# EAGLE design main (EAGLE 9.5.2)
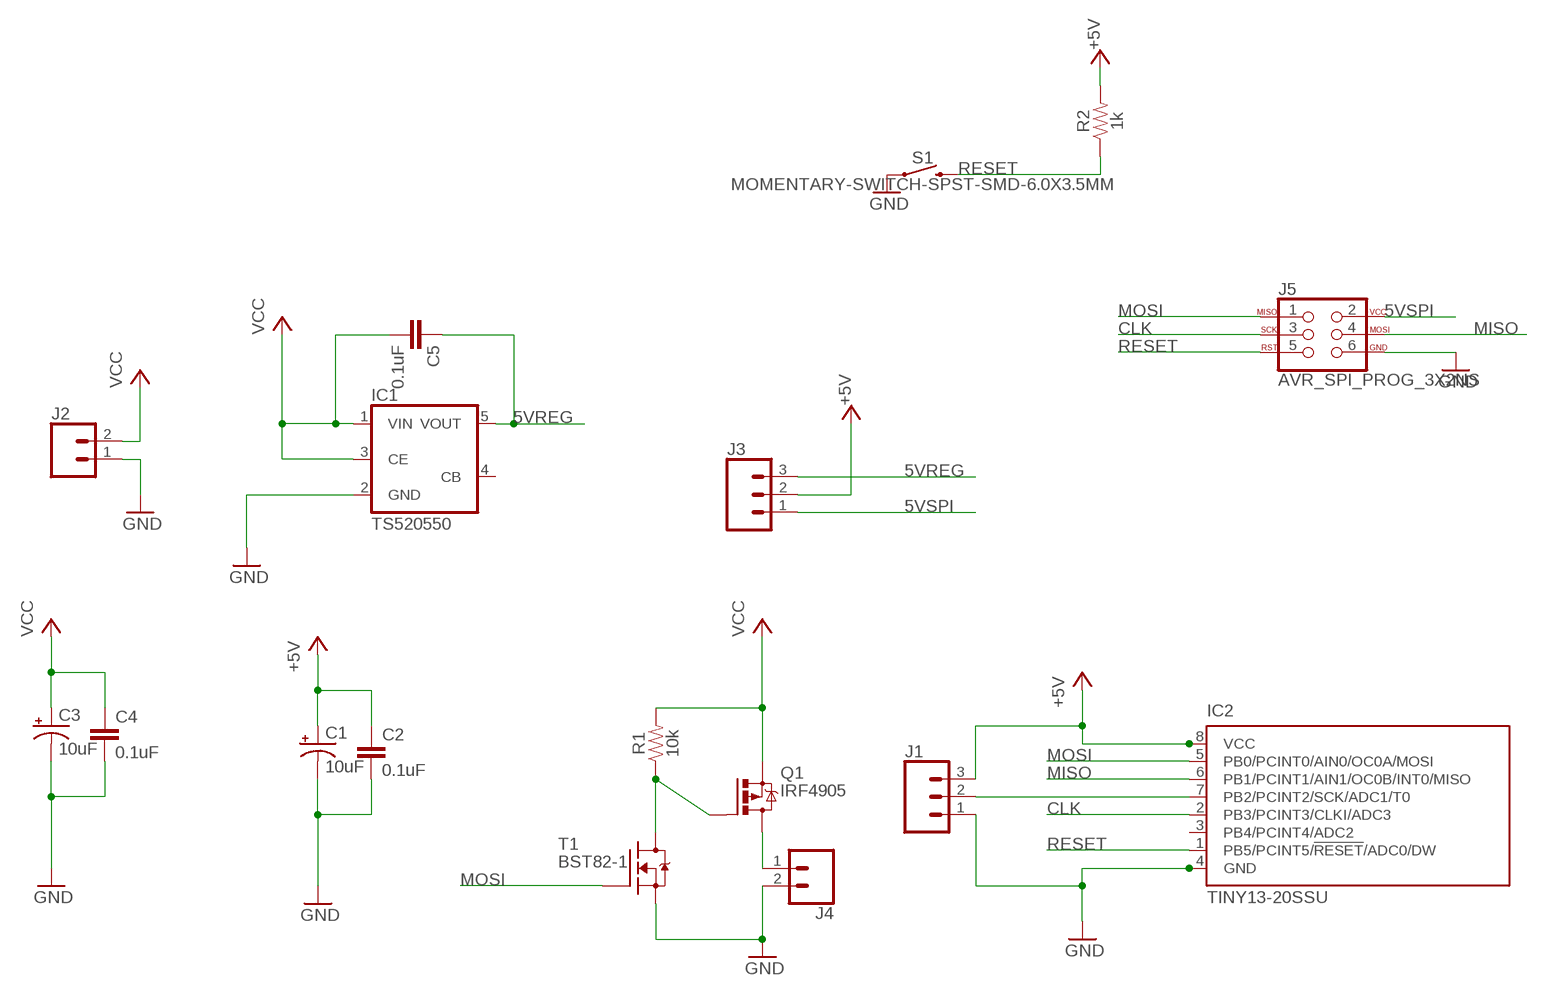
[diagram p0: schematic, sheet 1]

## Parts
C1  10uF  10UF-POLAR-RADIAL-2.5MM-25V-20%  [CPOL-RADIAL-2.5MM-5MM]
C2  0.1uF  0.1UF-0603-25V-5%  [0603]
C3  10uF  10UF-POLAR-RADIAL-2.5MM-25V-20%  [CPOL-RADIAL-2.5MM-5MM]
C4  0.1uF  0.1UF-0603-25V-5%  [0603]
C5  0.1uF  0.1UF-0603-25V-5%  [0603]
IC1  TS520550  [SOT25]
IC2  TINY13-20SSU  [8S1]
J1  CONN_03  [1X03]
J2  CONN_023.5MM_LOCK  [SCREWTERMINAL-3.5MM-2_LOCK]
J3  CONN_03  [1X03]
J4  CONN_023.5MM  [SCREWTERMINAL-3.5MM-2]
J5  AVR_SPI_PROG_3X2NS  [2X3-NS]
Q1  IRF4905  [TO220BH]
R1  10k  10KOHM-0603-1/10W-1%  [0603]
R2  1k  1KOHM-0603-1/10W-1%  [0603]
S1  MOMENTARY-SWITCH-SPST-SMD-6.0X3.5MM  [TACTILE_SWITCH_SMD_6.0X3.5MM]
T1  BST82-1  [SOT23]

## Nets
5VREG: C5.1 IC1.5(VOUT) J3.3
5VSPI: J3.1 J5.2
+5V: C1.1(+) C2.1 IC2.8(VCC) J1.3 J3.2 R2.2
CLK: IC2.2(PB3/PCINT3/CLKI/ADC3) J5.3
GND: C1.2(-) C2.2 C3.2(-) C4.2 IC1.2(GND) IC2.4(GND) J1.1 J2.1 J4.2 J5.6 S1.1 T1.2(S)
MISO: IC2.6(PB1/PCINT1/AIN1/OC0B/INT0/MISO) J5.4
MOSI: IC2.5(PB0/PCINT0/AIN0/OC0A/MOSI) J5.1 T1.1(G)
N$1: J4.1 Q1.D
N$2: IC2.7(PB2/PCINT2/SCK/ADC1/T0) J1.2
N$3: Q1.G R1.1 T1.3(D)
RESET: IC2.1(PB5/PCINT5/!RESET!/ADC0/DW) J5.5 R2.1 S1.2
VCC: C3.1(+) C4.1 C5.2 IC1.1(VIN) IC1.3(CE) J2.2 Q1.S R1.2
Unconnected: IC1.4(CB) IC2.3(PB4/PCINT4/ADC2)

## Library data of the parts
C1 C3 = SparkFun-Capacitors:10UF-POLAR: 10.0µF polarized capacitors A capacitor is a passive two-terminal electrical component used to store electrical energy temporarily in an electric field.; PROD_ID: CAP-08440
C2 C4 C5 = SparkFun-Capacitors:0.1UF: 0.1µF ceramic capacitors A capacitor is a passive two-terminal electrical component used to store electrical energy temporarily in an electric field.; PROD_ID: CAP-08604
IC1 = v-reg:TS5205: 150mA Low Noise LDO Voltage Regulator with Enable TSC [Taiwan Semiconductor Company, Ltd] Source: http://www.taiwansemi.com .. 5205_0409c.pdf
IC2 = atmel:TINY13: 8-bit AVR Microcontroller with 1K Bytes In-System Programmable Flash Source: http://www.atmel.com/dyn/resources/prod_documents/2535S.pdf; MPN: ATTINY13-20SSU; OC_FARNELL: 1455133; OC_NEWARK: 58M3771
J1 J3 = SparkFun-Connectors:CONN_03: Multi connection point. Often used as Generic Header-pin footprint for 0.1 inch spaced/style header connections On any of the 0.1 inch spaced packages, you can populate with these: Break Away Headers - Straight <https://www.sparkfun.com/products/116> (PRT-00116) Break Away Male Headers - Right Angle <https://www.sparkfun.com/products/553> (PRT-00553) Female Headers <https://www.sparkfun.com/products/115> (PRT-00115) Break Away Headers - Machine Pin <https://www.sparkfun.com/products/117> (PRT-00117) Break Away Female Headers - Swiss Machine Pin <https://www.sparkfun.com/products/743> (PRT-00743) Stackable Header - 3 Pin (Female, 0.1") <https://www.sparkfun.com/products/13875> (PRT-13875) For SCREWTERMINALS and SPRING TERMINALS visit here: Screw Terimnals on SparkFun.com <https://www.sparkfun.com/search/results?term=Screw+Terminals> (5mm/3.5mm/2.54mm spacing) This device is also useful as a general connection point to wire up your design to another part of your project. Our various solder wires solder well into these plated through hole pads. Hook-Up Wire - Assortment (Stranded, 22 AWG) <https://www.sparkfun.com/products/11375> (PRT-11375) Hook-Up Wire - Assortment (Solid Core, 22 AWG) <https://www.sparkfun.com/products/11367> (PRT-11367) View the entire wire category on our website here <https://www.sparkfun.com/categories/141> Special notes: Molex polarized connector foot print use with SKU : PRT-08232 with associated crimp pins and housings.
J2 J4 = SparkFun-Connectors:CONN_02: Multi connection point. Often used as Generic Header-pin footprint for 0.1 inch spaced/style header connections On any of the 0.1 inch spaced packages, you can populate with these: Break Away Headers - Straight <https://www.sparkfun.com/products/116> (PRT-00116) Break Away Male Headers - Right Angle <https://www.sparkfun.com/products/553> (PRT-00553) Female Headers <https://www.sparkfun.com/products/115> (PRT-00115) Break Away Headers - Machine Pin <https://www.sparkfun.com/products/117> (PRT-00117) Break Away Female Headers - Swiss Machine Pin <https://www.sparkfun.com/products/743> (PRT-00743) For SCREWTERMINALS and SPRING TERMINALS visit here: Screw Terimnals on SparkFun.com <https://www.sparkfun.com/search/results?term=Screw+Terminals> (5mm/3.5mm/2.54mm spacing) This device is also useful as a general connection point to wire up your design to another part of your project. Our various solder wires solder well into these plated through hole pads. Hook-Up Wire - Assortment (Stranded, 22 AWG) <https://www.sparkfun.com/products/11375> (PRT-11375) Hook-Up Wire - Assortment (Solid Core, 22 AWG) <https://www.sparkfun.com/products/11367> (PRT-11367) View the entire wire category on our website here <https://www.sparkfun.com/categories/141> Special notes: Molex polarized connector foot print use with: PRT-08233 with associated crimp pins and housings. 2.54_SCREWTERM for use with PRT-10571. 3.5mm Screw Terminal footprints for PRT-08084 5mm Screw Terminal footprints for use with PRT-08432; PROD_ID: CONN-08399
J5 = SparkFun-Connectors:AVR_SPI_PROG_3X2: AVR ISP 6 Pin This is the reduced ISP connector for AVR programming. Common on Arduino. This footprint will take up less PCB space and can be used with a 10-pin to 6-pin adapter such as SKU: BOB-08508 **Special note about "TEST_POINT" package. The stop mask is on the top side, so if you want your programming test points to be on the bottom of your board, make sure to place this package on the bottom side of the board. This also ensure that the orientation to program from the bottom side will be correct. SparkFun Products: SparkFun ISP Pogo Adapter <https://www.sparkfun.com/products/11591> - NS Tiny AVR Programmer <https://www.sparkfun.com/products/11801> -PTH
Q1 = transistor-power:IRF4905: P-Channel HEXFET® Power MOSFET RDS(on)= 0.02 Ohm, ID = -74A Source: http://www.irf.com/product-info/datasheets/data/irf4905pbf.pdf
R1 = SparkFun-Resistors:10KOHM: 10kΩ resistor A resistor is a passive two-terminal electrical component that implements electrical resistance as a circuit element. Resistors act to reduce current flow, and, at the same time, act to lower voltage levels within circuits. - Wikipedia; PROD_ID: RES-00824
R2 = SparkFun-Resistors:1KOHM: 1kΩ resistor A resistor is a passive two-terminal electrical component that implements electrical resistance as a circuit element. Resistors act to reduce current flow, and, at the same time, act to lower voltage levels within circuits. - Wikipedia; PROD_ID: RES-07856
S1 = SparkFun-Switches:MOMENTARY-SWITCH-SPST: Momentary Switch (Pushbutton) - SPST Normally-open (NO) SPST momentary switches (buttons, pushbuttons). Variants PTH-12MM - 12mm square, through-hole Momentary Pushbutton Switch - 12mm Square <https://www.sparkfun.com/products/9190> (COM-09190) PTH-6.0MM, PTH-6.0MM-KIT - 6.0mm square, through-hole Mini Pushbutton Switch <https://www.sparkfun.com/products/97> (COM-00097) KIT package intended for soldering kit's - only one side of pads' copper is exposed. PTH-RIGHT-ANGLE-KIT - Right-angle, through-hole Right Angle Tactile Button <https://www.sparkfun.com/products/10791> - Used on SparkFun BigTime Watch Kit <https://www.sparkfun.com/products/11734> SMD-12MM - 12mm square, surface-mount Tactile Button - SMD (12mm) <https://www.sparkfun.com/products/12993> (COM-12993) Used on SparkFun PicoBoard <https://www.sparkfun.com/products/11888> SMD-4.5MM - 4.5mm Square Trackball Switch Used on SparkFun Blackberry Trackballer Breakout <https://www.sparkfun.com/products/13169> SMD-4.6MMX2.8MM - 4.60mm x 2.80mm, surface mount Used on SparkFun SAMD21 Mini Breakout <https://www.sparkfun.com/products/13664> SMD-5.2MM, SMD-5.2-REDUNDANT - 5.2mm square, surface-mount Mini Pushbutton Switch - SMD <https://www.sparkfun.com/products/8720> (COM-08720) Used on Arduino Pro Mini <https://www.sparkfun.com/products/11114> REDUNDANT package connects both switch circuits together SMD-6.0X3.5MM - 6.0 x 3.5mm, surface mount Momentary Reset Switch SMD <https://www.sparkfun.com/products/8229> (COM-08229) SMD-6.2MM-TALL - 6.2mm square, surface mount Tactile Button - SMD (6mm) <https://www.sparkfun.com/products/12992> Used on SparkFun Digital Sandbox <https://www.sparkfun.com/products/12651> SMD-RIGHT-ANGLE - Right-angle, surface mount Used on SparkFun Block for Intel® Edison - Arduino <https://www.sparkfun.com/products/13036>; PROD_ID: SWCH-00815; SF_SKU: COM-08229
T1 = Test:BST82-1

## Board
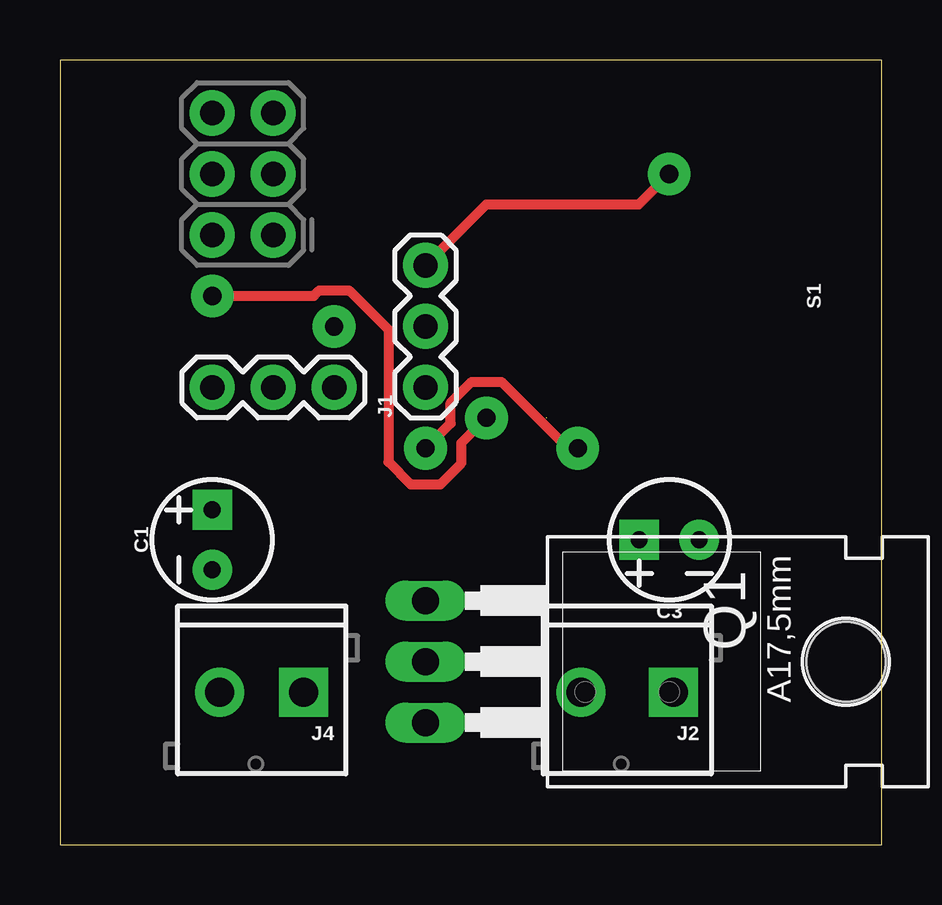
[diagram p1: board, top side]
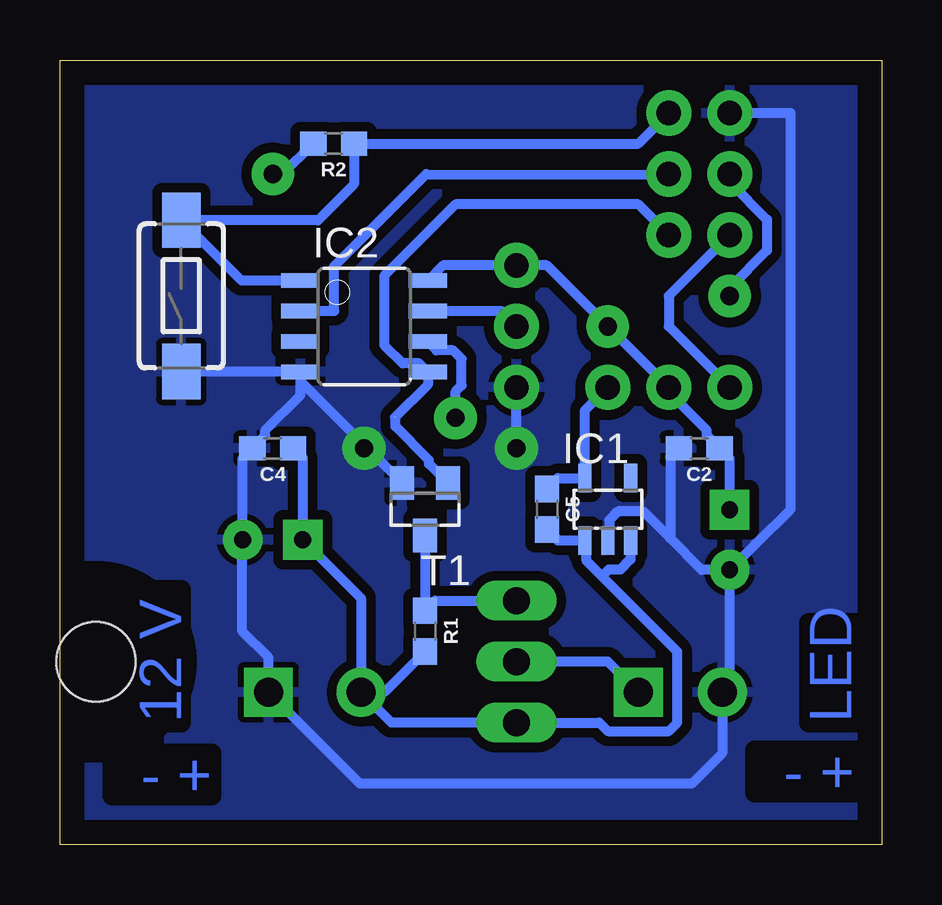
[diagram p2: board, bottom side, seen from below]

Size 34.27 x 32.69 mm. Coordinates in mm from the lower left corner, seen from the top.
Outline: 0,0 34.27,0 34.27,32.69 0,32.69 0,0
Copper layers (1*16): Top 0.035mm / dielectric 1.5mm / Bottom 0.035mm
Design rules "default *": minimum track width 16mil, minimum drill 0.35mm, track to track 16mil, track to pad 16mil, pad to pad 16mil, via to via 16mil, smd to smd 16mil, copper to edge 40mil, drill to drill 6mil, minimum pad ring 10mil, minimum via ring 8mil, stop-mask expansion 4mil, vias tented up to drill 0mil, thermal gap 10mil

### Footprints (pad centres in the part's own frame; a part is rotated, then mirrored left to right if it is on the bottom)
CPOL-RADIAL-2.5MM-5MM = drill 0.7 pad 1.651 square: 1 1.25,0 | drill 0.7 pad 1.651: 2 -1.25,0
0603 = smd 1.1 x 1: 1 -0.85,0; 2 0.85,0
SOT25 = smd 0.55 x 1.2: 1 -0.95,-1.3; 2 0,-1.3; 3 0.95,-1.3; 4 0.95,1.3; 5 -0.95,1.3
8S1 = smd 0.6 x 1.6: 1 -1.905,-2.654; 2 -0.645,-2.654; 3 0.625,-2.654; 4 1.895,-2.654; 5 1.905,2.654; 6 0.635,2.654; 7 -0.635,2.654; 8 -1.905,2.654
1X03 = drill 1.016 pad 1.88: 1 0,0; 2 2.54,0; 3 5.08,0
SCREWTERMINAL-3.5MM-2_LOCK = drill 1.2 pad 2.032 square: 1 -0.178,0 | drill 1.2 pad 2.032: 2 3.678,0
SCREWTERMINAL-3.5MM-2 = drill 1.2 pad 2.032 square: 1 0,0 | drill 1.2 pad 2.032: 2 3.5,0
2X3-NS = drill 1.016 pad 1.88: 1 -2.54,-1.27; 2 -2.54,1.27; 3 0,-1.27; 4 0,1.27; 5 2.54,-1.27; 6 2.54,1.27
TO220BH = drill 1.118 long: D 0,-6.35; G -2.54,-6.35; S 2.54,-6.35 | hole 3.302: 0,11.176
TACTILE_SWITCH_SMD_6.0X3.5MM = smd 2.3 x 1.6: 1 -3.15,0; 2 3.15,0
SOT23 = smd 1 x 1.4: 1 -0.95,-1.1; 2 0.95,-1.1; 3 0,1.1

### Placement (x,y rotation side)
C1  6.35,12.7 90 top
C2  7.62,16.51 180 bottom
C3  25.4,12.7 180 top
C4  25.4,16.51 180 bottom
C5  13.97,13.97 270 bottom
IC1  11.43,13.97 0 bottom
IC2  21.59,21.59 270 bottom
J1  15.24,19.05 90 top
J2  25.4,6.35 180 top
J3  6.35,19.05 0 top
J4  10.16,6.35 180 top
J5  7.62,27.94 90 top
Q1  21.59,7.62 270 top
R1  19.05,8.89 270 bottom
R2  22.86,29.21 180 bottom
S1  29.21,22.86 90 bottom
T1  19.05,13.97 180 bottom

### Tracks (layer width: path | path; a pad name or v marks a point on that pad's centre or on a via)
5VREG
  Bottom 0.406: C5.1 13.52,15.27 IC1.5 12.38,18.1 J3.3
5VSPI
  Bottom 0.406: J5.2 8.89,22.86 8.89,21.59 J3.1
+5V  (via drill 0.76 pad 1.78)
  Top 0.406: J1.3 17.78,26.67 24.13,26.67 v25.4,27.94
  Bottom 0.406: C1.1 6.35,16.09 C2.1 7.31,17.05 7.31,17.26 8.89,18.84 J3.2 v11.43,21.59 13.97,24.13 J1.3 18.3,24.13 IC2.8 | v25.4,27.94 24.98,27.94 R2.2
CLK
  Bottom 0.406: J5.3 8.92,27.91 19,27.94 22.83,24.1 22.83,22.23 IC2.2
GND  (via drill 0.76 pad 1.78)
  Top 0.406: v21.59,16.51 21.17,16.51 18.4,19.28 17.16,19.28 16.28,18.4 16.28,17.55 v15.24,16.51
  Bottom 0.406: 29.21,19.05 28.57,19.7 IC2.4 24.24,19.31 | T1.2 24.24,19.31 | 24.24,19.31 24.24,18.73 25.71,17.26 25.71,17.05 C4.2 26.65,16.11 C3.2 26.67,12.68 26.67,8.89 25.58,7.8 J2.1 21.77,2.54 7.93,2.54 6.66,3.81 J4.2 6.35,6.66 C1.2 | IC1.2 11.37,12.73 11.37,13.52 11.01,13.88 9.95,13.88 8.83,12.76 | C1.2 7.52,11.45 8.83,12.76 | C2.2 8.83,16.15 8.83,12.76 | C1.2 5.29,12.52 5.27,12.52 3.81,13.98 3.81,30.48 J5.6 | v15.24,16.51 J1.1
  pour Bottom: 0,33.02 0,0 34.29,0 34.29,33.02
MISO  (via drill 0.76 pad 1.78)
  Top 0.406: v6.35,22.86 10.58,22.86 10.81,23.09 12.05,23.09 13.69,21.45 13.69,15.94 14.62,15.01 15.86,15.01 16.74,15.89 16.74,16.74 v17.78,17.78
  Bottom 0.406: J5.4 6.35,27.59 4.8,26.04 4.8,24.76 6.35,23.21 v6.35,22.86 | v17.78,17.78 17.78,18.88 17.53,19.13 17.53,20.24 17.88,20.59 18.58,20.59 IC2.6
MOSI  (1 unrouted)
  Bottom 0.406: T1.1 18.89,15.86 18.89,16.02 20.29,17.42 20.29,17.78 | 20.3,17.8 18.94,19.16 IC2.5 19.3,20.05 19.99,20.05 20.75,20.81 20.75,23.7 17.78,26.67 10.16,26.67 J5.1 9.3,25.81
N$1
  Bottom 0.406: J4.1 11.43,7.62 Q1.D
N$2
  Bottom 0.406: J1.2 15.88,22.23 IC2.7
N$3
  Bottom 0.406: T1.3 R1.1 18.63,10.16 Q1.G
RESET
  Bottom 0.406: IC2.1 26.7,23.5 S1.2 23.52,26.01 22.01,27.52 R2.1 10.16,29.21 J5.5
VCC
  Bottom 0.406: J2.2 20.45,5.08 Q1.S 11.78,5.08 11.43,4.72 8.89,4.72 8.53,5.08 8.53,8.04 11.68,11.18 | C4.1 24.15,16.11 C3.1 21.72,10.27 J2.2 | 11.68,11.18 12.31,11.82 12.31,12.61 IC1.1 13.52,12.67 C5.2 | 11.68,11.18 11.4,11.46 10.9,11.46 10.48,11.88 IC1.3 | R1.2 20.74,6.35 J2.2

### Text on the board
Bottom: LED | 12 V | - + | - +